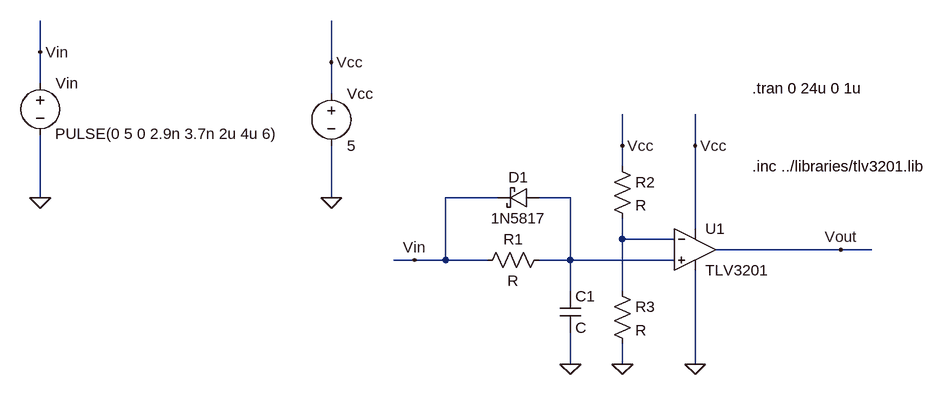
[diagram p0: schematic Draft1.asc]
Draft1.asc, the LTspice schematic file:
Version 4
SHEET 1 880 680
WIRE -800 -144 -800 -192
WIRE -352 -128 -352 -192
WIRE -800 -96 -800 -144
WIRE -352 -80 -352 -128
WIRE 96 0 96 -48
WIRE 208 0 208 -48
WIRE 96 32 96 0
WIRE -800 80 -800 -16
WIRE -352 80 -352 0
WIRE -96 80 -176 80
WIRE 16 80 -32 80
WIRE 208 128 208 0
WIRE 96 144 96 112
WIRE 176 144 96 144
WIRE 432 160 240 160
WIRE 480 160 432 160
WIRE -224 176 -256 176
WIRE -176 176 -176 80
WIRE -176 176 -224 176
WIRE -112 176 -176 176
WIRE 16 176 16 80
WIRE 16 176 -32 176
WIRE 176 176 16 176
WIRE 16 224 16 176
WIRE 96 224 96 144
WIRE 16 336 16 288
WIRE 96 336 96 304
WIRE 208 336 208 192
FLAG 16 336 0
FLAG 96 336 0
FLAG -352 80 0
FLAG -352 -128 Vcc
FLAG 96 0 Vcc
FLAG 208 0 Vcc
FLAG 208 336 0
FLAG -800 80 0
FLAG -800 -144 Vin
FLAG -224 176 Vin
FLAG 432 160 Vout
SYMBOL OpAmps\\opamp2 208 96 R0
SYMATTR InstName U1
SYMATTR Value TLV3201
SYMBOL res -16 160 R90
WINDOW 0 0 56 VBottom 2
WINDOW 3 32 56 VTop 2
SYMATTR InstName R1
SYMBOL cap 0 224 R0
SYMATTR InstName C1
SYMBOL res 80 16 R0
SYMATTR InstName R2
SYMBOL res 80 208 R0
SYMATTR InstName R3
SYMBOL voltage -352 -96 R0
WINDOW 123 0 0 Left 0
WINDOW 39 0 0 Left 0
SYMATTR InstName Vcc
SYMATTR Value 5
SYMBOL schottky -32 64 R90
WINDOW 0 0 32 VBottom 2
WINDOW 3 32 32 VTop 2
SYMATTR InstName D1
SYMATTR Value 1N5817
SYMATTR Description Diode
SYMATTR Type diode
SYMBOL voltage -800 -112 R0
WINDOW 3 195 109 Bottom 2
WINDOW 123 0 0 Left 0
WINDOW 39 0 0 Left 0
SYMATTR InstName Vin
SYMATTR Value PULSE(0 5 0 2.9n 3.7n 2u 4u 6)
TEXT 296 32 Left 2 !.inc ../libraries/tlv3201.lib
TEXT 296 -88 Left 2 !.tran 0 24u 0 1u

The netlist it stands for:
* Draft1.asc
XU1 N001 N002 Vcc 0 Vout TLV3201  ; pins In+ In- V+ V- OUT
R1 N001 Vin R
C1 N001 0 C
R2 Vcc N002 R
R3 N002 0 R
Vcc Vcc 0 5
D1 N001 Vin 1N5817
Vin Vin 0 PULSE(0 5 0 2.9n 3.7n 2u 4u 6)
.model D D
.lib standard.dio
.inc ../libraries/tlv3201.lib
.tran 0 24u 0 1u
.backanno
.end